# EAGLE schematic board1 (EAGLE 7.5.0)
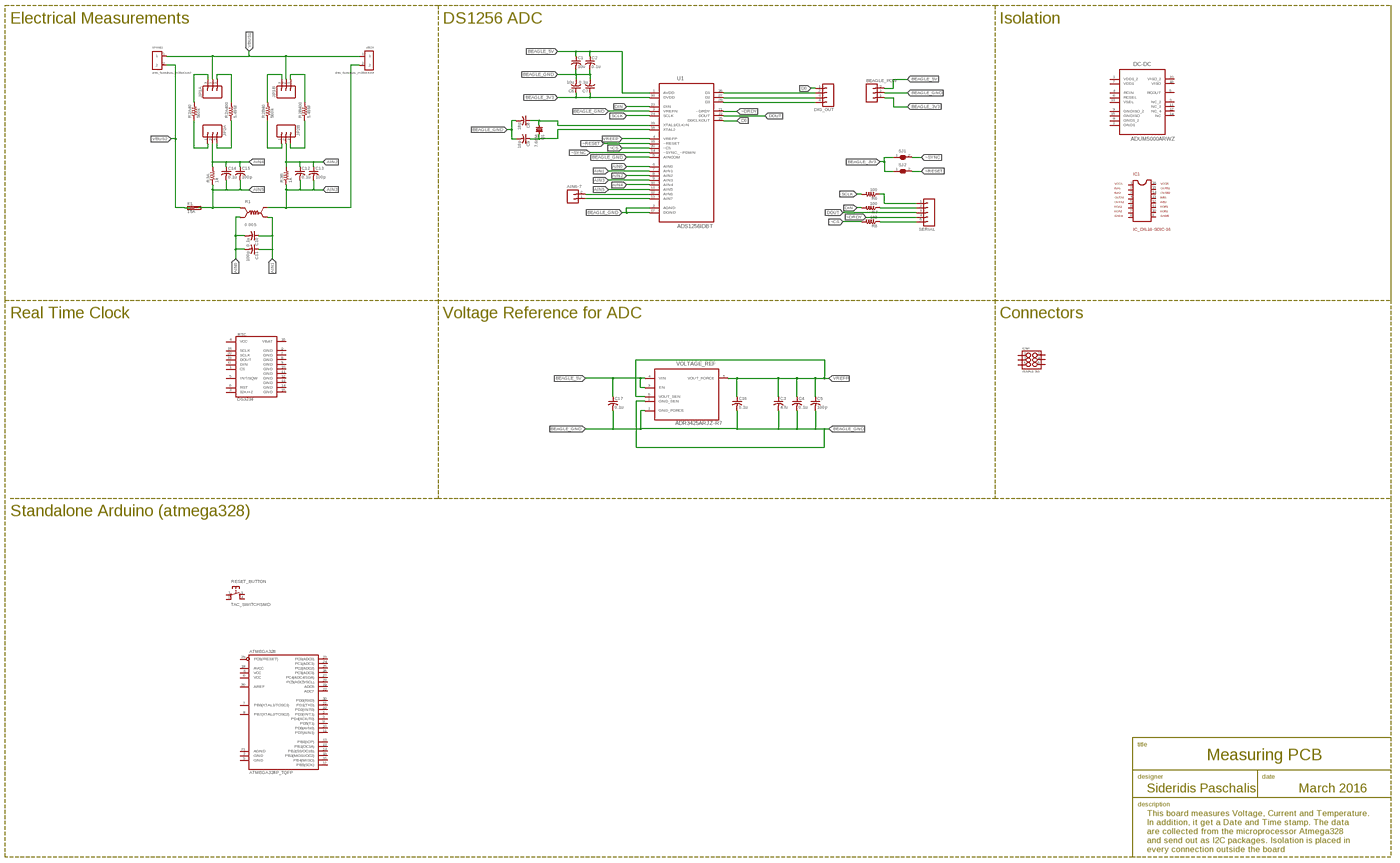
[diagram p0: schematic, sheet 1, overview]
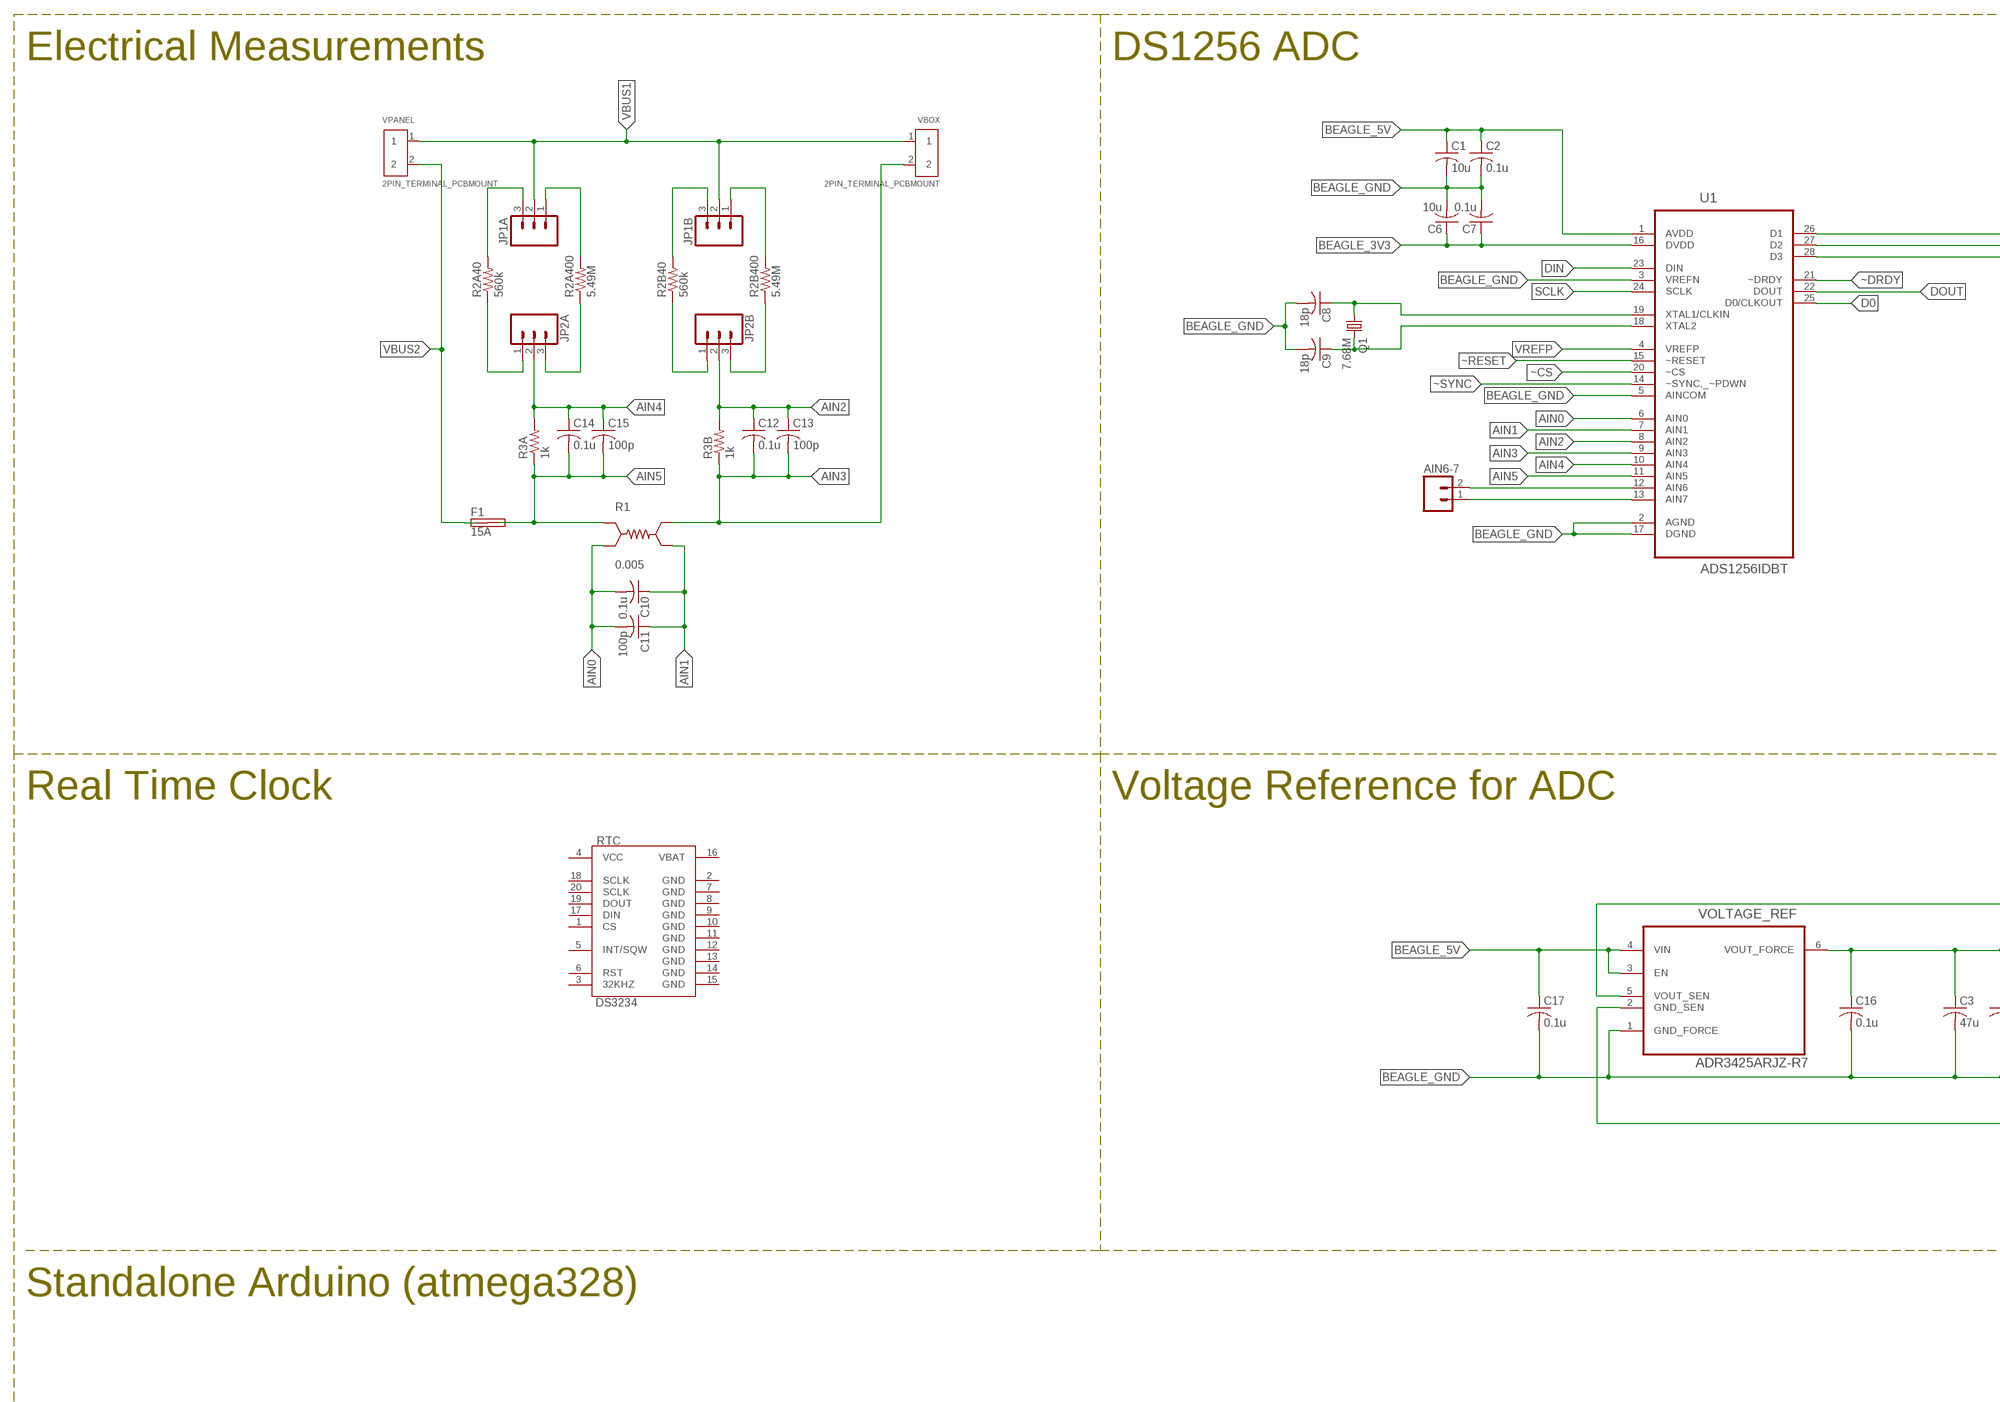
[diagram p1: schematic, sheet 1, part 1 of 4]
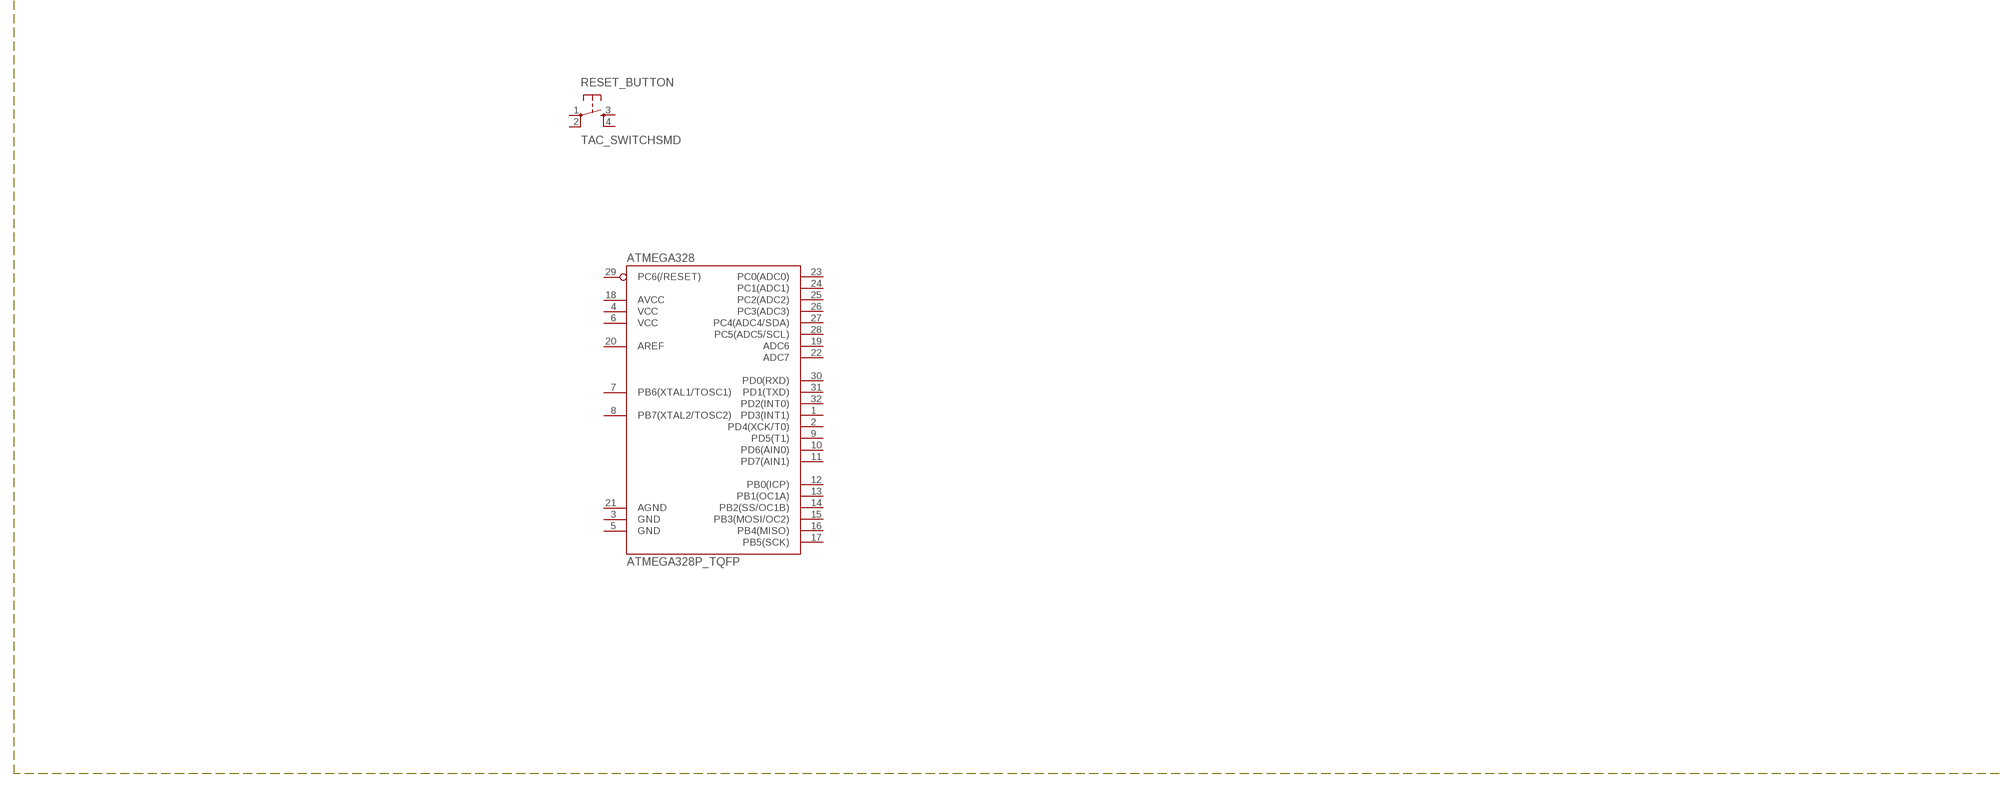
[diagram p2: schematic, sheet 1, part 2 of 4]
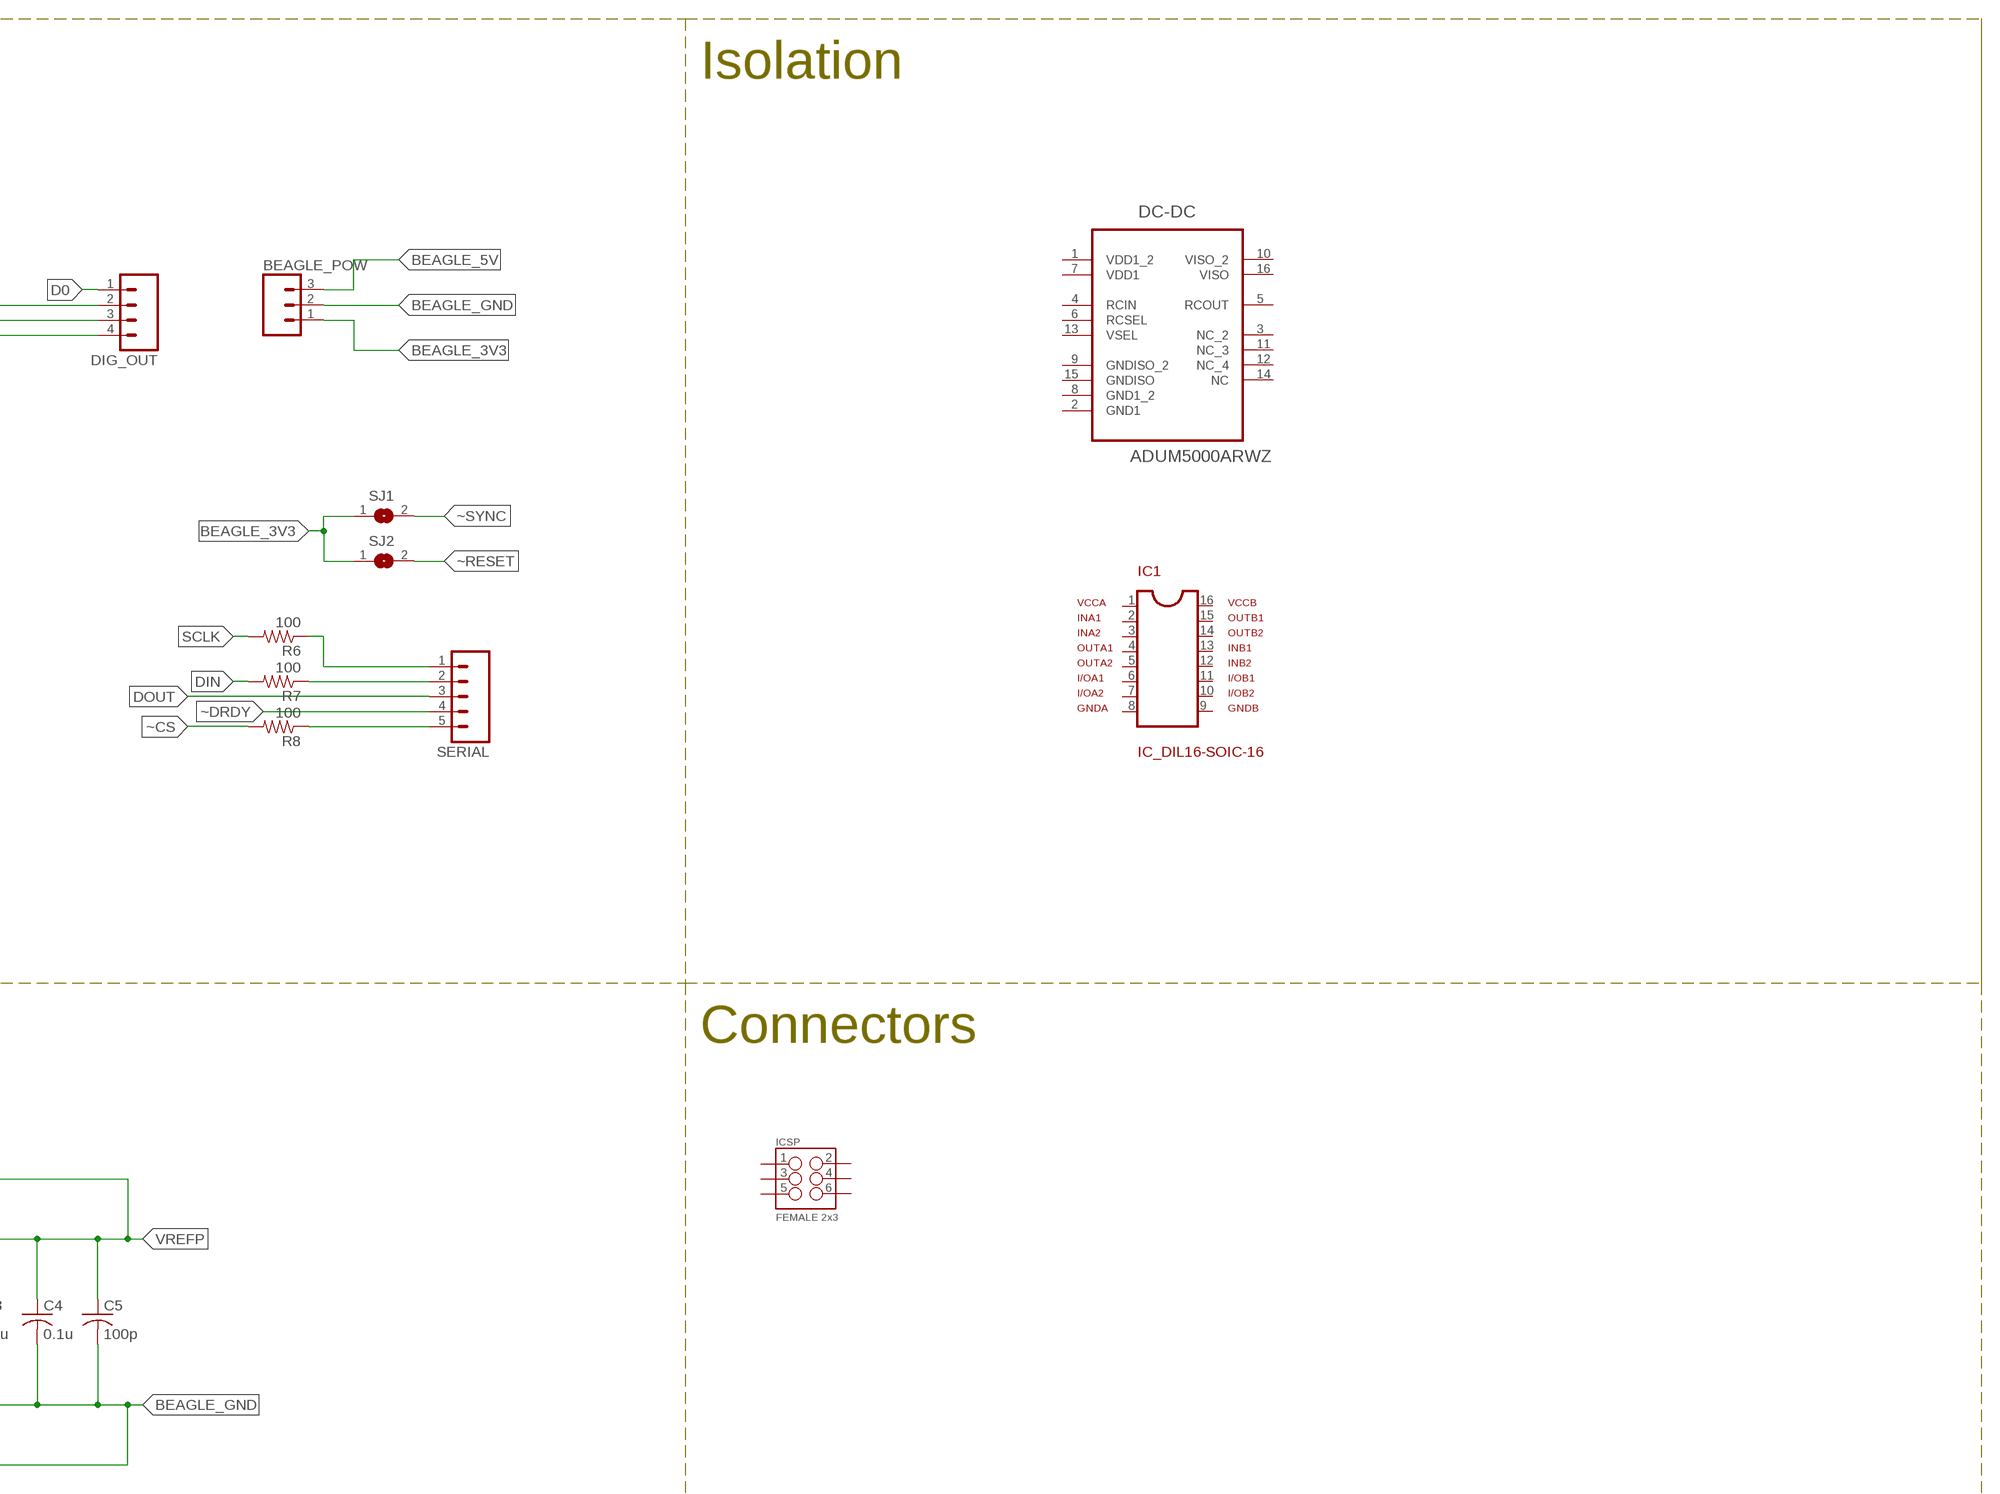
[diagram p3: schematic, sheet 1, part 3 of 4]
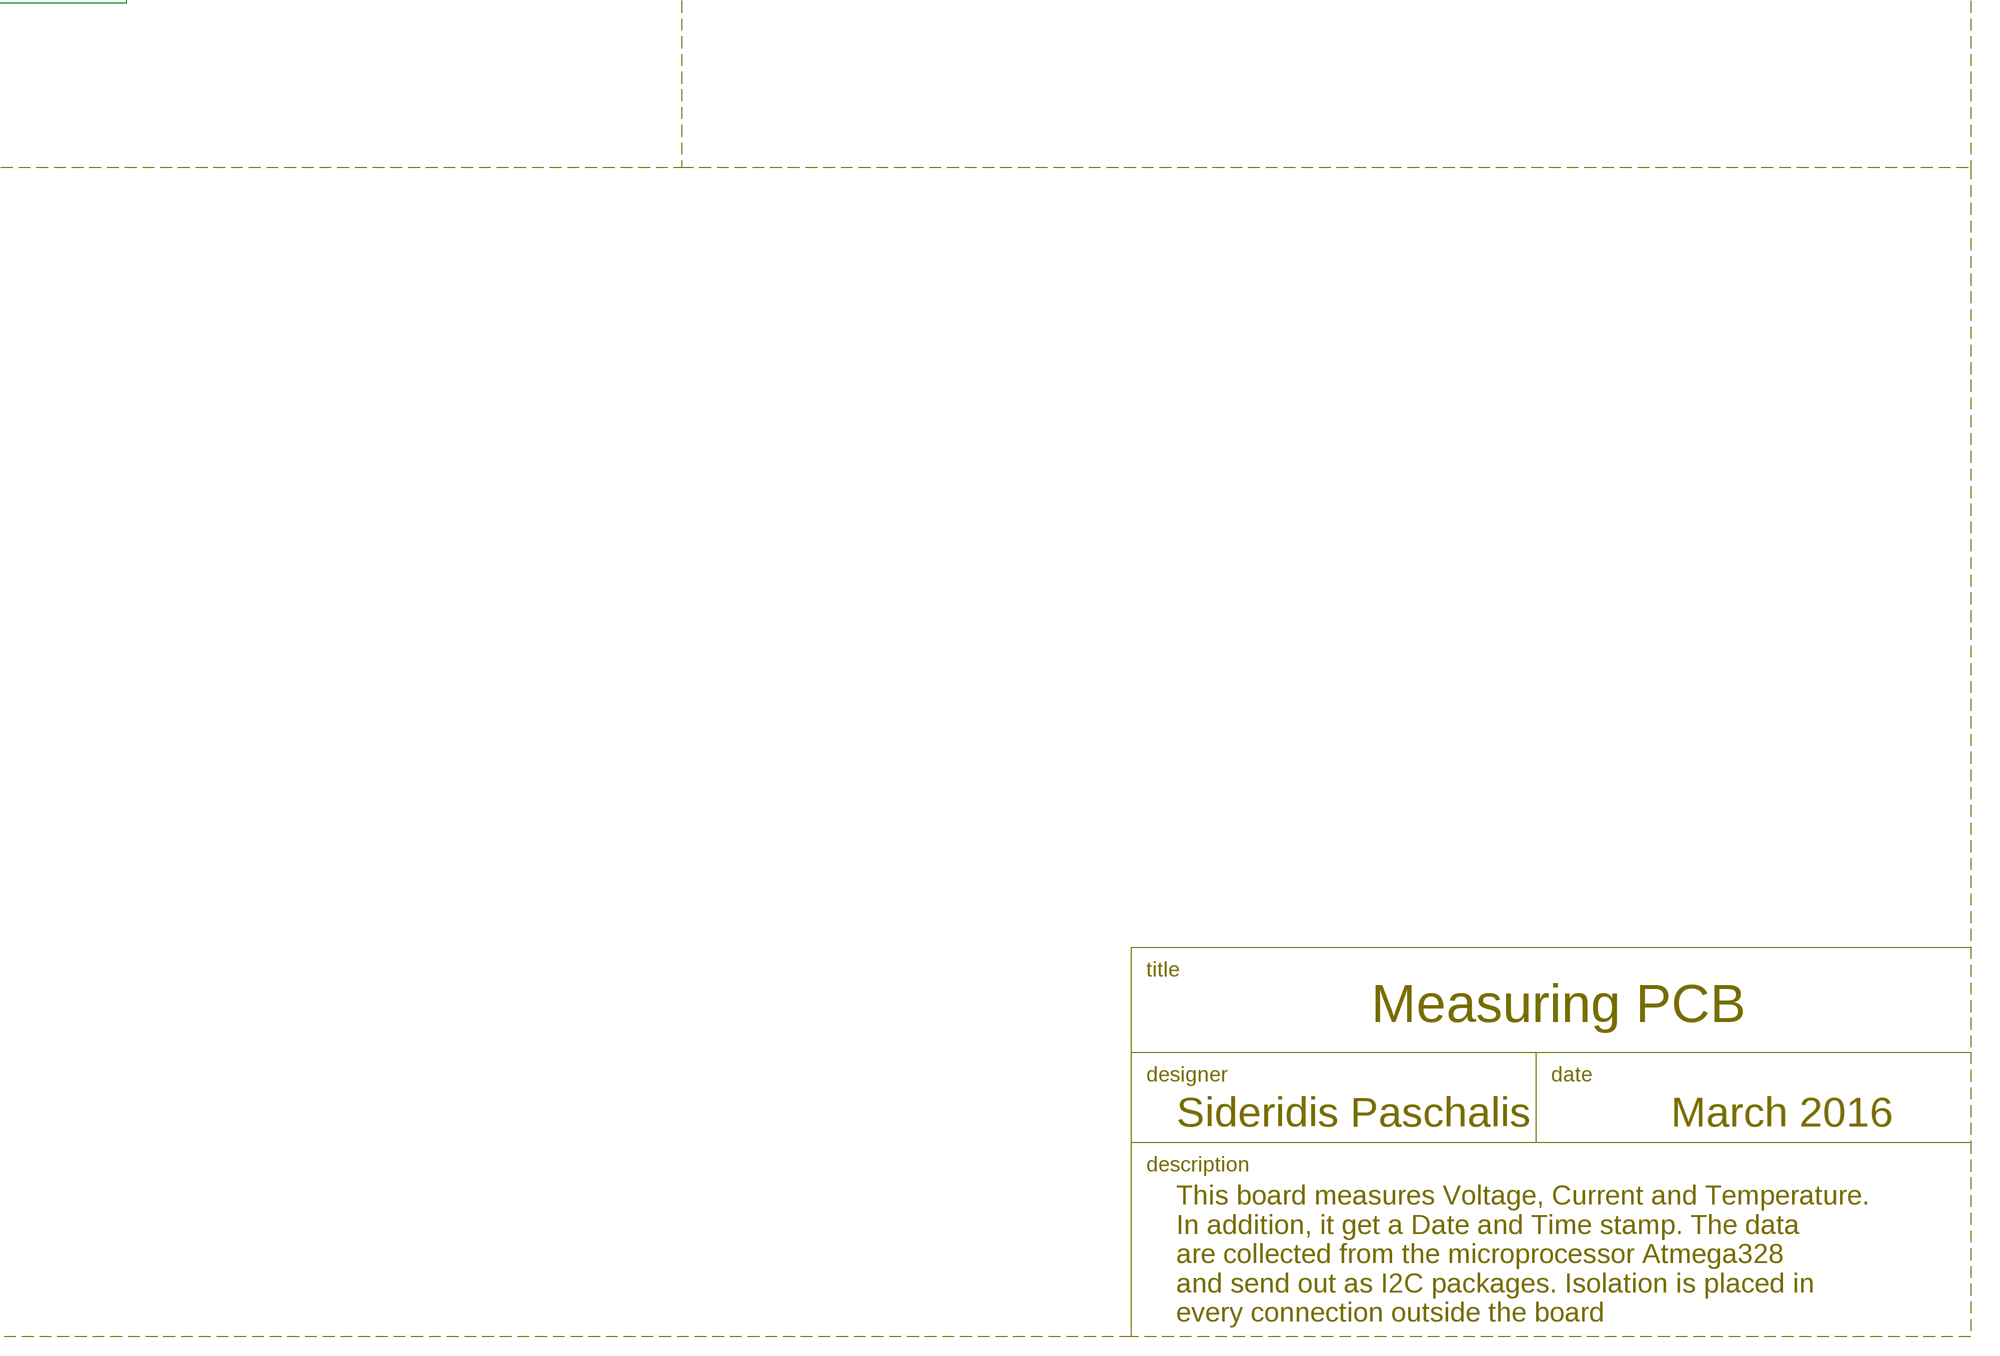
[diagram p4: schematic, sheet 1, part 4 of 4]

## Parts
AIN6-7  M02PTH  [1X02]
ATMEGA328  ATMEGA328P_TQFP  [TQFP32-08]
BEAGLE_POW  M03PTH  [1X03]
C1  10u  C-USC3216  [C3216]
C2  0.1u  C-USC3216  [C3216]
C3  47u  C-USC3216  [C3216]
C4  0.1u  C-USC3216  [C3216]
C5  100p  C-USC3216  [C3216]
C6  10u  C-USC3216  [C3216]
C7  0.1u  C-USC3216  [C3216]
C8  18p  C-USC3216  [C3216]
C9  18p  C-USC3216  [C3216]
C10  0.1u  C-USC3216  [C3216]
C11  100p  C-USC3216  [C3216]
C12  0.1u  C-USC3216  [C3216]
C13  100p  C-USC3216  [C3216]
C14  0.1u  C-USC3216  [C3216]
C15  100p  C-USC3216  [C3216]
C16  0.1u  C-USC3216  [C3216]
C17  0.1u  C-USC3216  [C3216]
DC-DC  ADUM5000ARWZ  [SOIC127P1032X265-16N]
DIG_OUT  M04PTH  [1X04]
F1  15A  SHK20L  [SHK20L]
IC1  IC_DIL16-SOIC-16  [SOIC-16]
ICSP  FEMALE 2x3  M03X2FEMALE  [2X3]
JP1A  M03PTH  [1X03]
JP1B  M03PTH  [1X03]
JP2A  M03PTH  [1X03]
JP2B  M03PTH  [1X03]
Q1  7.68M  CRYSTALHC49U-V  [HC49U-V]
R1  0.005  LVK25R001  [LVK25]
R2A40  560k  R-US_M3216  [M3216]
R2A400  5.49M  R-US_M3216  [M3216]
R2B40  560k  R-US_M3216  [M3216]
R2B400  5.49M  R-US_M3216  [M3216]
R3A  1k  R-US_M3216  [M3216]
R3B  1k  R-US_M3216  [M3216]
R6  100  R-US_M3216  [M3216]
R7  100  R-US_M3216  [M3216]
R8  100  R-US_M3216  [M3216]
RESET_BUTTON  TAC_SWITCHSMD  [TACTILE-SWITCH-SMD]
RTC  DS3234  [DS3234]
SERIAL  M05PTH  [1X05]
SJ1  SJ  [SJ]
SJ2  SJ  [SJ]
U1  ADS1256IDBT  [SOP65P780X200-28N]
VBOX  2PIN_TERMINAL_PCBMOUNT  [2TERMINALBLOCK_10MMPITCH]
VOLTAGE_REF  ADR3425ARJZ-R7  [SOT95P280X145-6N]
VPANEL  2PIN_TERMINAL_PCBMOUNT  [2TERMINALBLOCK_10MMPITCH]

## Nets
AIN0: C10.2 C11.2 R1.INV U1.6(AIN0)
AIN1: C10.1 C11.1 R1.OUTV U1.7(AIN1)
AIN2: C12.1 C13.1 JP2B.2 R3B.2 U1.8(AIN2)
AIN3: C12.2 C13.2 R1.OUTI R3B.1 U1.9(AIN3) VBOX.2
AIN4: C14.1 C15.1 JP2A.2 R3A.2 U1.10(AIN4)
AIN5: C14.2 C15.2 F1.2A F1.2B R1.INI R3A.1 U1.11(AIN5)
BEAGLE_3V3: BEAGLE_POW.1 C6.1 C7.1 SJ1.1 SJ2.1 U1.16(DVDD)
BEAGLE_5V: BEAGLE_POW.3 C1.1 C2.1 C17.1 U1.1(AVDD) VOLTAGE_REF.3(EN) VOLTAGE_REF.4(VIN)
BEAGLE_GND: BEAGLE_POW.2 C1.2 C2.2 C3.2 C4.2 C5.2 C6.2 C7.2 C8.2 C9.2 C16.2 C17.2 U1.2(AGND) U1.3(VREFN) U1.5(AINCOM) U1.17(DGND) VOLTAGE_REF.1(GND_FORCE) VOLTAGE_REF.2(GND_SEN)
D0: DIG_OUT.1 U1.25(D0/CLKOUT)
DIN: R7.2 U1.23(DIN)
DOUT: SERIAL.3 U1.22(DOUT)
N$2: JP1A.3 R2A40.2
N$3: JP1A.1 R2A400.2
N$4: JP2A.3 R2A400.1
N$5: JP2A.1 R2A40.1
N$6: DIG_OUT.2 U1.26(D1)
N$7: JP1B.3 R2B40.2
N$8: JP1B.1 R2B400.2
N$9: JP2B.3 R2B400.1
N$10: JP2B.1 R2B40.1
N$11: C8.1 Q1.1 U1.19(XTAL1/CLKIN)
N$12: C9.1 Q1.2 U1.18(XTAL2)
N$13: DIG_OUT.3 U1.27(D2)
N$15: DIG_OUT.4 U1.28(D3)
N$16: R7.1 SERIAL.2
N$17: R6.1 SERIAL.1
N$18: AIN6-7.2 U1.12(AIN6)
N$19: AIN6-7.1 U1.13(AIN7)
N$22: R8.1 SERIAL.5
SCLK: R6.2 U1.24(SCLK)
VBUS1: JP1A.2 JP1B.2 VBOX.1 VPANEL.1
VBUS2: F1.1A F1.1B VPANEL.2
VREFP: C3.1 C4.1 C5.1 C16.1 U1.4(VREFP) VOLTAGE_REF.5(VOUT_SEN) VOLTAGE_REF.6(VOUT_FORCE)
~CS: R8.2 U1.20(~CS)
~DRDY: SERIAL.4 U1.21(~DRDY)
~RESET: SJ2.2 U1.15(~RESET)
~SYNC: SJ1.2 U1.14(~SYNC,_~PDWN)
Unconnected: ATMEGA328.1(PD3(INT1)) ATMEGA328.2(PD4(XCK/T0)) ATMEGA328.3(GND) ATMEGA328.4(VCC) ATMEGA328.5(GND) ATMEGA328.6(VCC) ATMEGA328.7(PB6(XTAL1/TOSC1)) ATMEGA328.8(PB7(XTAL2/TOSC2)) ATMEGA328.9(PD5(T1)) ATMEGA328.10(PD6(AIN0)) ATMEGA328.11(PD7(AIN1)) ATMEGA328.12(PB0(ICP)) ATMEGA328.13(PB1(OC1A)) ATMEGA328.14(PB2(SS/OC1B)) ATMEGA328.15(PB3(MOSI/OC2)) ATMEGA328.16(PB4(MISO)) ATMEGA328.17(PB5(SCK)) ATMEGA328.18(AVCC) ATMEGA328.19(ADC6) ATMEGA328.20(AREF) ATMEGA328.21(AGND) ATMEGA328.22(ADC7) ATMEGA328.23(PC0(ADC0)) ATMEGA328.24(PC1(ADC1)) ATMEGA328.25(PC2(ADC2)) ATMEGA328.26(PC3(ADC3)) ATMEGA328.27(PC4(ADC4/SDA)) ATMEGA328.28(PC5(ADC5/SCL)) ATMEGA328.29(PC6(/RESET)) ATMEGA328.30(PD0(RXD)) ATMEGA328.31(PD1(TXD)) ATMEGA328.32(PD2(INT0)) DC-DC.2(GND1) DC-DC.3(NC_2) DC-DC.4(RCIN) DC-DC.5(RCOUT) DC-DC.6(RCSEL) DC-DC.8(GND1_2) DC-DC.9(GNDISO_2) DC-DC.10(VISO_2) DC-DC.11(NC_3) DC-DC.12(NC_4) DC-DC.13(VSEL) DC-DC.14(NC) DC-DC.15(GNDISO) DC-DC.16(VISO) IC1.1(VCCA) IC1.2(INA1) IC1.3(INA2) IC1.4(OUTA1) IC1.5(OUTA2) IC1.6(I/OA1) IC1.7(I/OA2) IC1.8(GNDA) IC1.9(GNDB) IC1.10(I/OB2) IC1.11(I/OB1) IC1.12(INB2) IC1.13(INB1) IC1.14(OUTB2) IC1.15(OUTB1) IC1.16(VCCB) ICSP.1 ICSP.2 ICSP.3 ICSP.4 ICSP.5 ICSP.6 RESET_BUTTON.1 RESET_BUTTON.2 RESET_BUTTON.3 RESET_BUTTON.4 RTC.1(CS) RTC.2(GND) RTC.3(32KHZ) RTC.4(VCC) RTC.5(INT/SQW) RTC.6(RST) RTC.7(GND) RTC.8(GND) RTC.9(GND) RTC.10(GND) RTC.11(GND) RTC.12(GND) RTC.13(GND) RTC.14(GND) RTC.15(GND) RTC.16(VBAT) RTC.17(DIN) RTC.18(SCLK) RTC.19(DOUT) RTC.20(SCLK)

## Notes on the sheet
- Electrical Measurements | DS1256 ADC | Isolation
- Real Time Clock | Voltage Reference for ADC | Connectors
- Standalone Arduino (atmega328)
- title
- Measuring PCB
- designer | date
- Sideridis Paschalis | March 2016
- description
- This board measures Voltage, Current and Temperature.
  In addition, it get a Date and Time stamp. The data
  are collected from the microprocessor Atmega328
  and send out as I2C packages. Isolation is placed in
  every connection outside the board

## Power pins joined to a net without a drawn wire
VDD1: DC-DC.7(VDD1)
VDD1_2: DC-DC.1(VDD1_2)

## Library data of the parts
AIN6-7 = SparkFun-Connectors:M02: Standard 2-pin 0.1" header. Use with - straight break away headers ( PRT-00116) - right angle break away headers (PRT-00553) - swiss pins (PRT-00743) - machine pins (PRT-00117) - female headers (PRT-00115) Molex polarized connector foot print use with: PRT-08233 with associated crimp pins and housings. 2.54_SCREWTERM for use with PRT-10571. 3.5mm Screw Terminal footprints for PRT-08084 5mm Screw Terminal footprints for use with PRT-08432
ATMEGA328 = SparkFun-DigitalIC:ATMEGA328P_TQFP; PROD_ID: IC-09069
BEAGLE_POW JP1A JP1B JP2A JP2B = SparkFun-Connectors:M03: Header 3 Standard 3-pin 0.1" header. Use with straight break away headers (SKU : PRT-00116), right angle break away headers (PRT-00553), swiss pins (PRT-00743), machine pins (PRT-00117), and female headers (PRT-00115). Molex polarized connector foot print use with SKU : PRT-08232 with associated crimp pins and housings.
C1-C17 = adafruit:C-US: CAPACITOR, American symbol
DC-DC = Analog Devices_By_element14_Batch_1:ADUM5000ARWZ: 2.5 kV, Isolated DC-to-DC Converter; MPN: ADUM5000ARWZ; OC_FARNELL: 1701256; OC_NEWARK: 19P8235; PACKAGE: SOIC-16; SUPPLIER: Analog Devices
DIG_OUT = SparkFun-Connectors:M04: Header 4 Standard 4-pin 0.1" header. Use with straight break away headers (SKU : PRT-00116), right angle break away headers (PRT-00553), swiss pins (PRT-00743), machine pins (PRT-00117), and female headers (PRT-00115). Molex polarized connector foot print use with SKU : PRT-08231 with associated crimp pins and housings. 1MM SMD Version SKU: PRT-10208
F1 = fuse:SHK20L: FUSE HOLDER 5 x 20 mm, SH contact, SHH1 Schukat, E1073 Buerklin; OC_FARNELL: unknown; OC_NEWARK: unknown
IC1 = MAX14850ASE:IC_DIL16
ICSP = SparkFun-Connectors:M03X2: 2x3 .1" header. Shrouded, with keying- CONN-10681 SMT- CONN-11415 Pogo pins- HW-11044; PROD_ID: CONN-11566
Q1 = adafruit:CRYSTAL: CRYSTAL; OC_FARNELL: 1666969; OC_NEWARK: unknown
R1 = LVK25:LVK25
R2A40 R2A400 R2B40 R2B400 R3A R3B R6-R8 = adafruit:R-US_: RESISTOR, American symbol
RESET_BUTTON = SparkFun-Retired:TAC_SWITCH: Momentary Switch Button commonly used for reset or general input. Spark Fun Electronics SKU : COM-00097 SMT- SWCH-08247; PROD_ID: SWCH-08247
RTC = SparkFun-FreqCtrl:DS3234: SPI RTC module with battery backup and internal clock.
SERIAL = SparkFun-Connectors:M05: Header 5 Standard 5-pin 0.1" header. Use with straight break away headers (SKU : PRT-00116), right angle break away headers (PRT-00553), swiss pins (PRT-00743), machine pins (PRT-00117), and female headers (PRT-00115). Molex polarized connector foot print use with SKU : PRT-08230 with associated crimp pins and housings.
SJ1 SJ2 = jumper:SJ: SMD solder JUMPER
U1 = Texas Instruments_By_element14_Batch_1:ADS1256IDBT: ADC; MPN: ADS1256IDBT; OC_FARNELL: 1470337; OC_NEWARK: 73H4119; PACKAGE: SSOP-28; SUPPLIER: TEXAS INSTRUMENTS
VBOX VPANEL = TE CONNECTIVITY:2PIN_TERMINAL_PCBMOUNT: 2 pin Terminal Connector Simple 2 pin Terminal Conector Pins: 2 Pitch: 10.0mm
VOLTAGE_REF = Analog Devices_By_element14_Batch_1:ADR3425ARJZ-R7: Micropower, High Accuracy Voltage References; MPN: ADR3425ARJZ-R7; OC_FARNELL: 1827384; OC_NEWARK: 67R2201; PACKAGE: SOT-23-6; SUPPLIER: Analog Devices